# EasyEDA schematic SCH_s2PC_2024-04-20.json
TITLE: ESP32_caculate; REV: v0.0.3; Date: 2024-04-15; Sheet: 1/1; Drawn By: maysrp; Company: maysrp
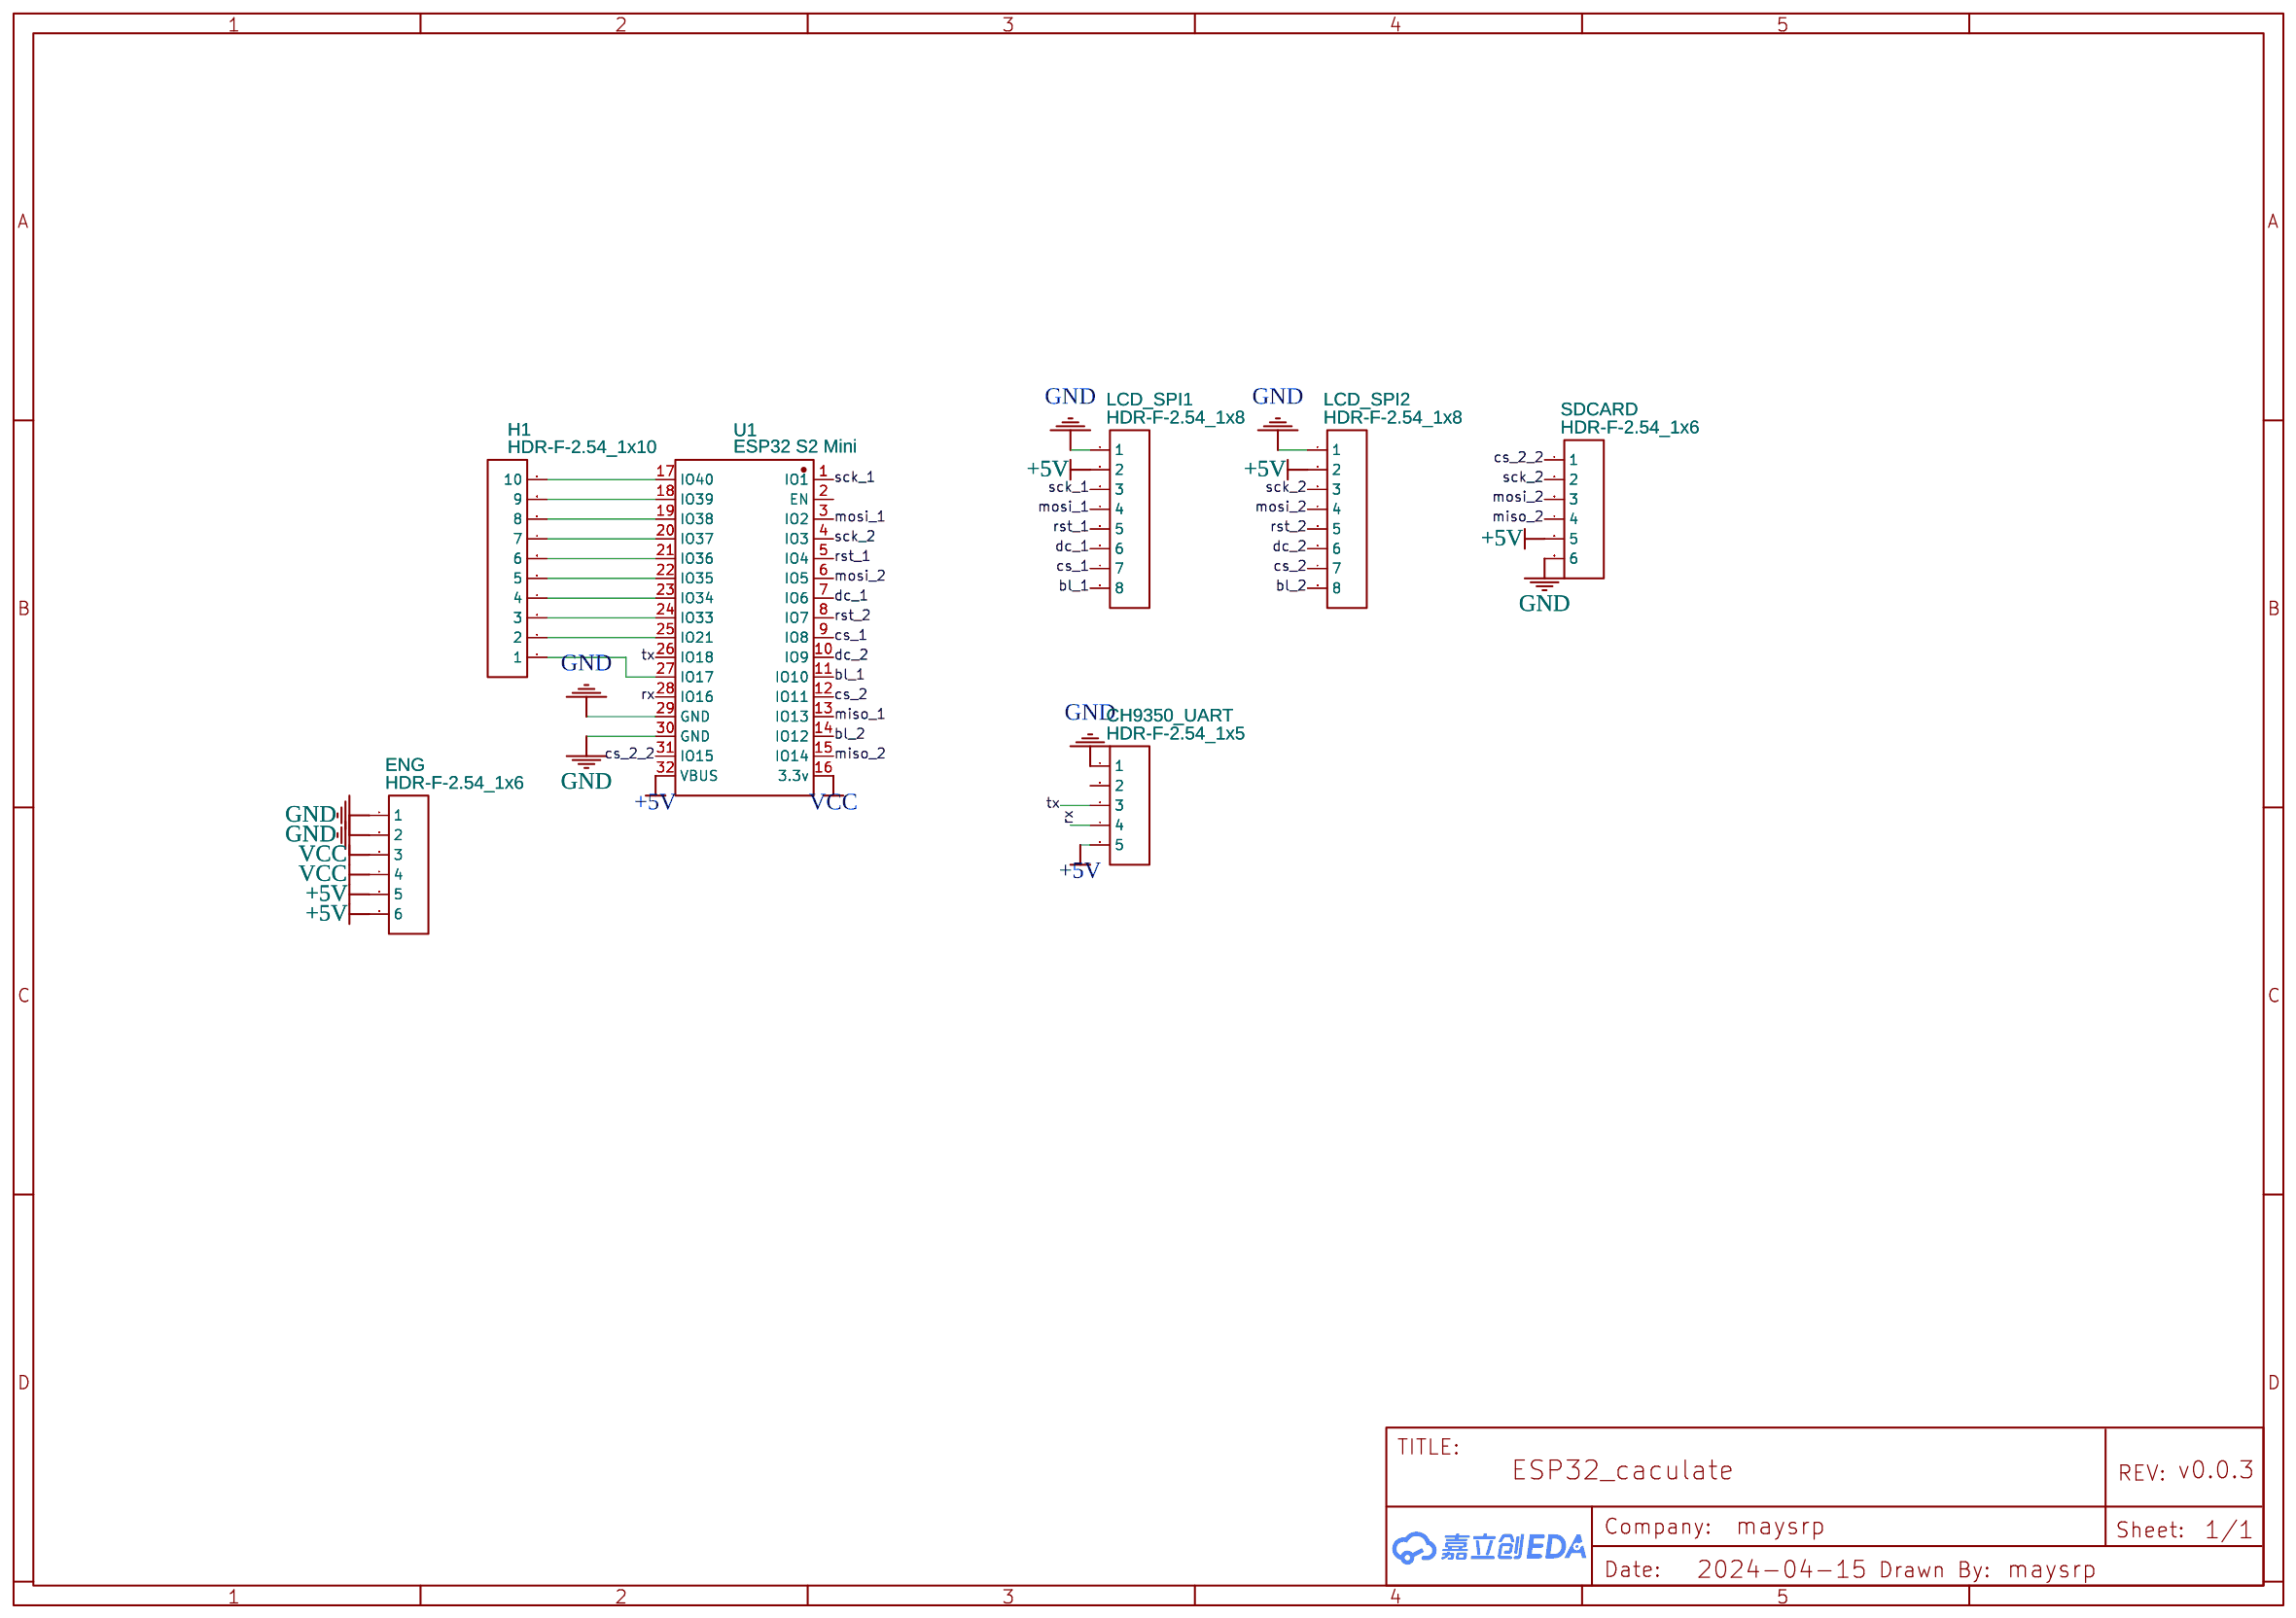
[diagram p0: schematic sheet]

## Parts
CH9350_UART  HDR-F-2.54_1x5  [HDR-F-2.54_1X5]
ENG  HDR-F-2.54_1x6  [HDR-F-2.54_1X6]
H1  HDR-F-2.54_1x10  [HDR-F-2.54_1X10]
LCD_SPI1  HDR-F-2.54_1x8  [HDR-F-2.54_1X8]
LCD_SPI2  HDR-F-2.54_1x8  [HDR-F-2.54_1X8]
SDCARD  HDR-F-2.54_1x6  [HDR-F-2.54_1X6]
U1  ESP32 S2 Mini  [ESP32S2 MINI]

## Library data of the parts
CH9350_UART = HDR-F-2.54_1x5: Supplier Part: C50950; Supplier: LCSC; Contributor: LCEDA_Lib
ENG SDCARD = HDR-F-2.54_1x6: Supplier Part: C40877; Supplier: LCSC; Contributor: LCEDA_Lib
H1 = HDR-F-2.54_1x10: Supplier Part: C35445; Supplier: LCSC; Contributor: LCEDA_Lib
LCD_SPI1 LCD_SPI2 = HDR-F-2.54_1x8: Supplier Part: C225505; Supplier: LCSC; Contributor: LCEDA_Lib
U1 = ESP32 S2 Mini: Contributor: symdhm

## Nets
+5V: CH9350_UART.5 ENG.5 ENG.6 LCD_SPI1.2 LCD_SPI2.2 SDCARD.5 U1.32(VBUS)
GND: CH9350_UART.1 ENG.1 ENG.2 LCD_SPI1.1 LCD_SPI2.1 SDCARD.6 U1.29(GND) U1.30(GND)
VCC: ENG.3 ENG.4 U1.16(3.3v)
bl_1: LCD_SPI1.8 U1.11(IO10)
bl_2: LCD_SPI2.8 U1.14(IO12)
cs_1: LCD_SPI1.7 U1.9(IO8)
cs_2: LCD_SPI2.7 U1.12(IO11)
cs_2_2: SDCARD.1 U1.31(IO15)
dc_1: LCD_SPI1.6 U1.7(IO6)
dc_2: LCD_SPI2.6 U1.10(IO9)
miso_1: U1.13(IO13)
miso_2: SDCARD.4 U1.15(IO14)
mosi_1: LCD_SPI1.4 U1.3(IO2)
mosi_2: LCD_SPI2.4 SDCARD.3 U1.6(IO5)
rst_1: LCD_SPI1.5 U1.5(IO4)
rst_2: LCD_SPI2.5 U1.8(IO7)
rx: CH9350_UART.4 U1.28(IO16)
sck_1: LCD_SPI1.3 U1.1(IO1)
sck_2: LCD_SPI2.3 SDCARD.2 U1.4(IO3)
tx: CH9350_UART.3 U1.26(IO18)
Net-(H1-1): H1.1 U1.27(IO17)
Net-(H1-2): H1.2 U1.25(IO21)
Net-(H1-3): H1.3 U1.24(IO33)
Net-(H1-4): H1.4 U1.23(IO34)
Net-(H1-5): H1.5 U1.22(IO35)
Net-(H1-6): H1.6 U1.21(IO36)
Net-(H1-7): H1.7 U1.20(IO37)
Net-(H1-8): H1.8 U1.19(IO38)
Net-(H1-9): H1.9 U1.18(IO39)
Net-(H1-10): H1.10 U1.17(IO40)

Not connected (* = marked no-connect by the designer): CH9350_UART 2; U1 2(EN)
